# EAGLE design HBridgeShield (EAGLE 8.4.1)
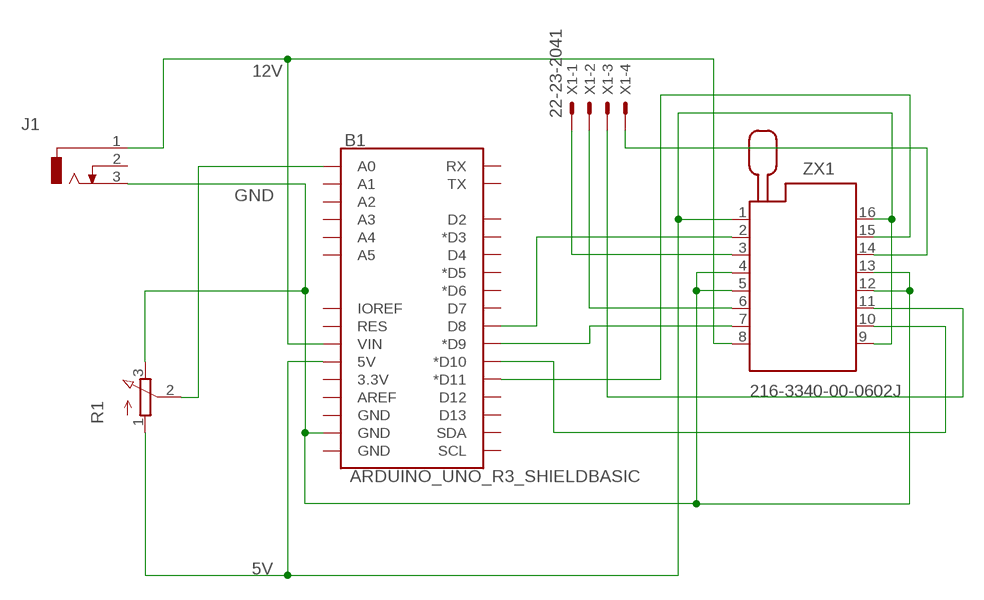
[diagram p0: schematic, sheet 1]

## Parts
B1  ARDUINO_UNO_R3_SHIELDBASIC  [UNO_R3_SHIELD]
J1  DCJ0303  [DCJ0303]
R1  3RP/1610N  [3RP/1610N]
X1  22-23-2041  [22-23-2041]
ZX1  216-3340-00-0602J  [216-3340-00-0602J]

## Nets
5V: B1.5V R1.1(A) ZX1.1 ZX1.9 ZX1.16
12V: B1.VIN J1.1 ZX1.8
GND: B1.GND@1(GND) J1.3 R1.3(E) ZX1.4 ZX1.5 ZX1.12 ZX1.13
N$1: B1.D9(*D9) ZX1.7
N$2: B1.D10(*D10) ZX1.10
N$3: B1.D8 ZX1.2
N$4: B1.D11(*D11) ZX1.15
N$5: X1.1 ZX1.3
N$6: B1.A0 R1.2(S)
N$7: X1.2 ZX1.6
N$8: X1.4 ZX1.14
N$9: X1.3 ZX1.11
Unconnected: B1.3.3V B1.A1 B1.A2 B1.A3 B1.A4 B1.A5 B1.AREF B1.D2 B1.D3(*D3) B1.D4 B1.D5(*D5) B1.D6(*D6) B1.D7 B1.D12 B1.D13 B1.GND@0(GND) B1.GND@2(GND) B1.IOREF B1.RES B1.RX B1.SCL B1.SDA B1.TX J1.2

## Library data of the parts
B1 = SparkFun-Boards:ARDUINO_UNO_R3_SHIELD: Arduino R3 Shield Footprint Shield form compatible with the Arduino Uno R3. SparkFun Products: MG2639 Cellular Shield <https://www.sparkfun.com/products/13120> MIDI Shield <https://www.sparkfun.com/products/12898> R3 Stackable Headers Kit <https://www.sparkfun.com/products/11417>
J1 = con-jack:DCJ0303: DC POWER JACK Source: DCJ0303.pdf; OC_FARNELL: unknown; OC_NEWARK: unknown
R1 = pot:3RP/1610N: 16mm Potentiometer one level Source: http://www.alphapotentiometers.net/html/16mm_pot_2.html
X1 = con-molex:22-23-2041: .100" (2.54mm) Center Header - 4 Pin; MF: MOLEX; MPN: 22-23-2041; OC_FARNELL: 1462920; OC_NEWARK: 38C0355
ZX1 = con-3m:216-3340-00-0602J: Zero Insertion Force Socked Source: http://www.3M.com/ehpd; MF: 3M; MPN: 216-3340-00-0602J; OC_FARNELL: 1674399; OC_NEWARK: 85K7797

## Board
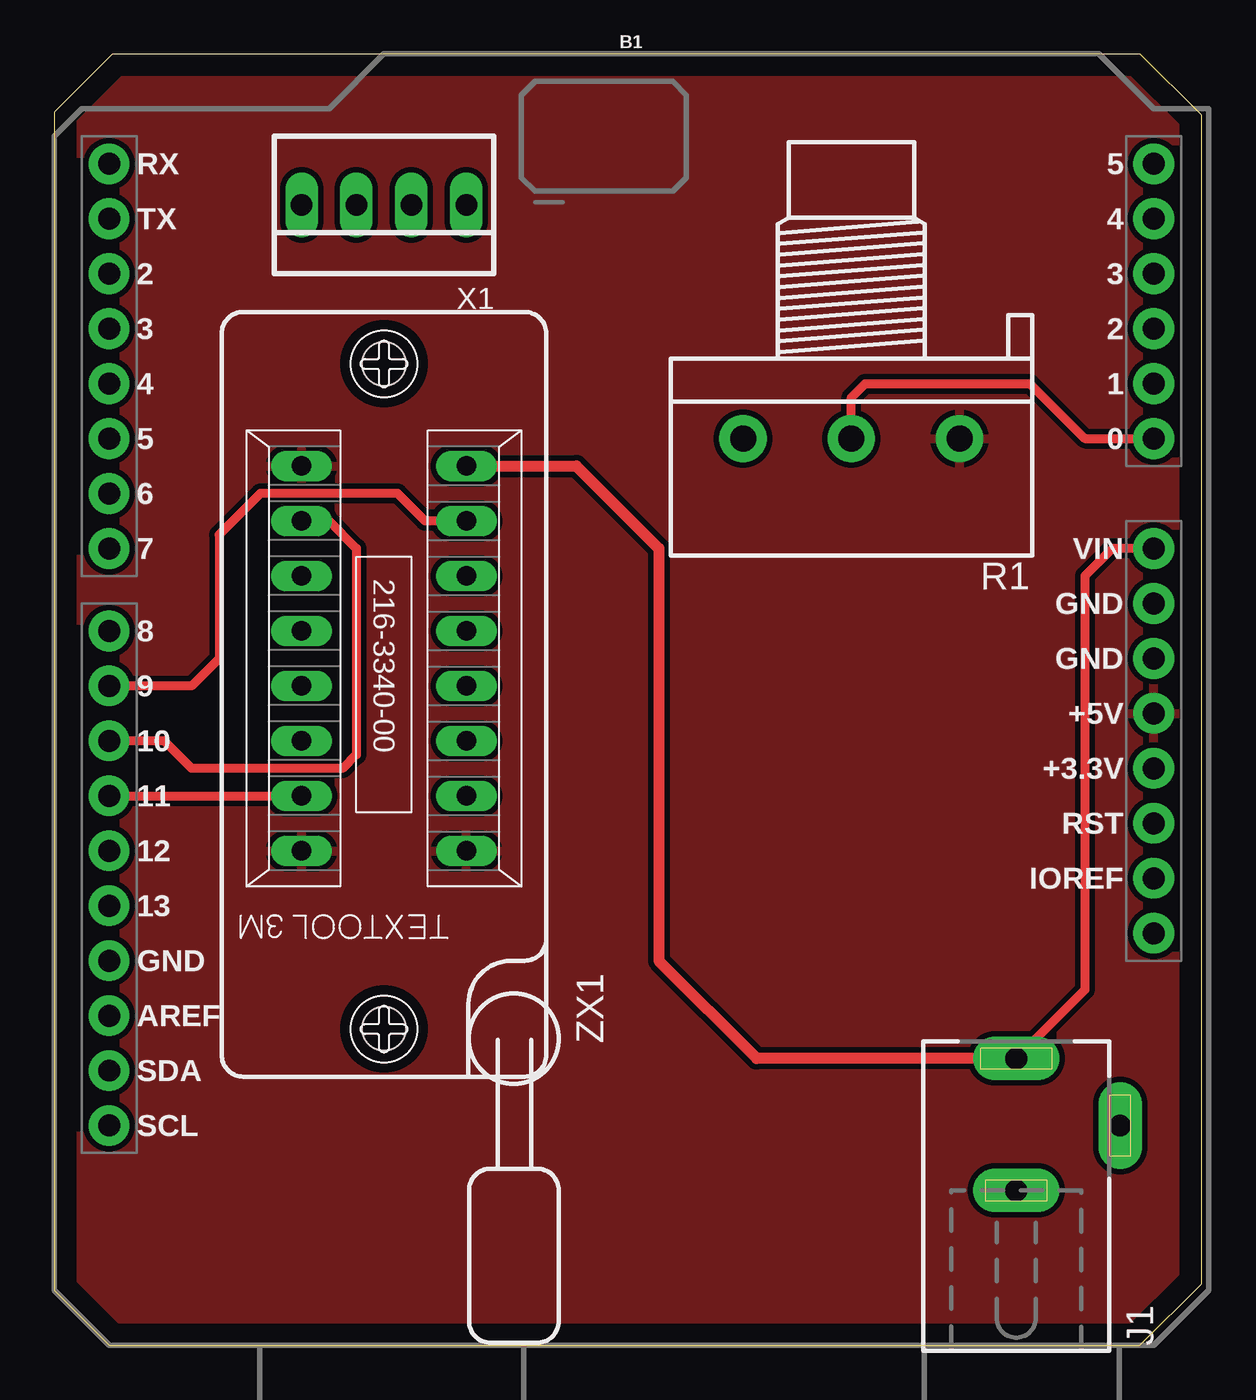
[diagram p1: board, top side]
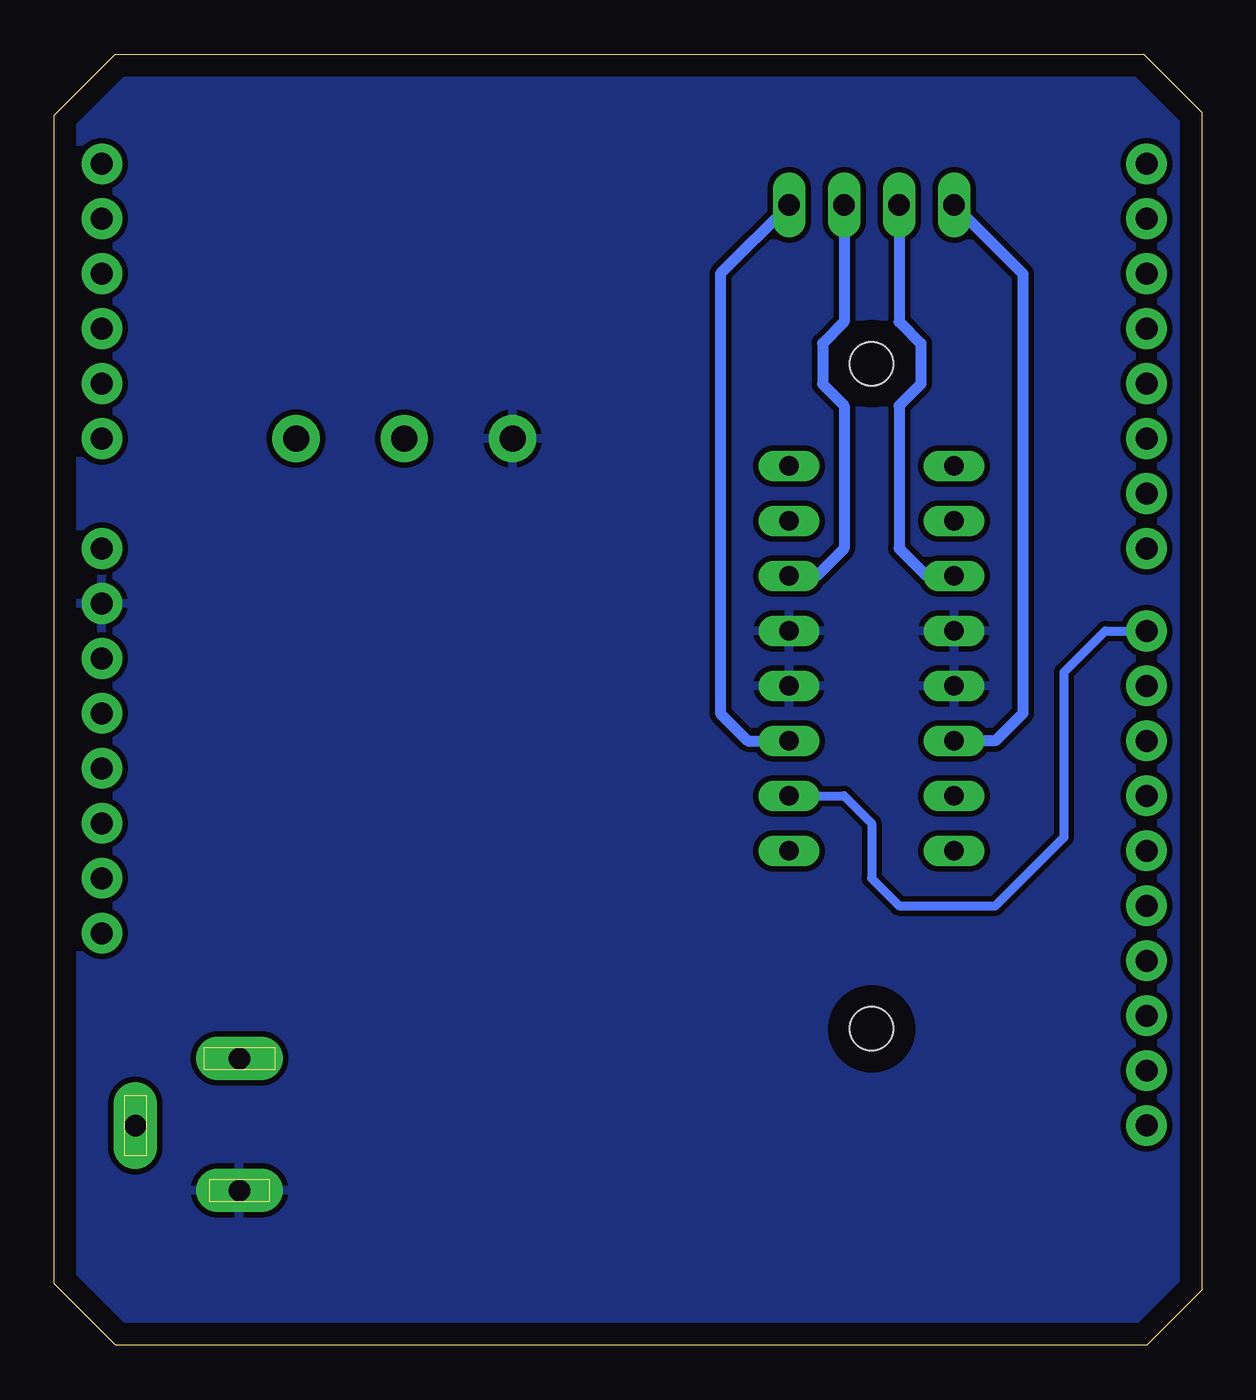
[diagram p2: board, bottom side, seen from below]

Size 53.01 x 59.68 mm. Coordinates in mm from the lower left corner, seen from the top.
Outline: 0,57 0,2.54 2.54,0 50.16,0 53.01,2.85 53.01,56.84 50.17,59.68 2.68,59.68 0,57
Copper layers (1*16): Top 0.035mm / dielectric 1.5mm / Bottom 0.035mm
Design rules "default": minimum track width 6mil, minimum drill 0.35mm, track to track 6mil, track to pad 6mil, pad to pad 6mil, via to via 6mil, smd to smd 6mil, copper to edge 40mil, drill to drill 6mil, minimum pad ring 10mil, minimum via ring 8mil, stop-mask expansion 4mil, vias tented up to drill 0mil, thermal gap 10mil

### Footprints (pad centres in the part's own frame; a part is rotated, then mirrored left to right if it is on the bottom)
UNO_R3_SHIELD = drill 1.016 pad 1.88: 3.3V 24.13,-2.54; 5V 24.13,0; A0 24.13,12.7; A1 24.13,15.24; A2 24.13,17.78; A3 24.13,20.32; A4 24.13,22.86; A5 24.13,25.4; AREF -24.13,-13.97; D2 -24.13,20.32; D3 -24.13,17.78; D4 -24.13,15.24; D5 -24.13,12.7; D6 -24.13,10.16; D7 -24.13,7.62; D8 -24.13,3.81; D9 -24.13,1.27; D10 -24.13,-1.27; D11 -24.13,-3.81; D12 -24.13,-6.35; D13 -24.13,-8.89; GND@0 24.13,2.54; GND@1 24.13,5.08; GND@2 -24.13,-11.43; IOREF 24.13,-7.62; NC 24.13,-10.16; RES 24.13,-5.08; RX -24.13,25.4; SCL -24.13,-19.05; SDA -24.13,-16.51; TX -24.13,22.86; VIN 24.13,7.62
DCJ0303 = drill 1 pad 2 long: 1 0,3.1; 2 4.8,0; 3 0,-3
3RP/1610N = drill 1.2 pad 2.184: 1 -5,0; 2 0,0; 3 5,0
22-23-2041 = drill 1 long: 1 -3.81,0; 2 -1.27,0; 3 1.27,0; 4 3.81,0
216-3340-00-0602J = drill 0.9 long: 1 -8.89,-3.81; 2 -6.35,-3.81; 3 -3.81,-3.81; 4 -1.27,-3.81; 5 1.27,-3.81; 6 3.81,-3.81; 7 6.35,-3.81; 8 8.89,-3.81; 9 8.89,3.81; 10 6.35,3.81; 11 3.81,3.81; 12 1.27,3.81; 13 -1.27,3.81; 14 -3.81,3.81; 15 -6.35,3.81; 16 -8.89,3.81 | hole 2: 13.62,0; -17.12,0

### Placement (x,y rotation side)
B1  26.67,29.21 0 top
J1  44.45,10.16 0 top
R1  36.83,41.91 180 top
X1  15.24,52.7 180 top
ZX1  15.24,31.75 90 top

### Tracks (layer width: path | path; a pad name or v marks a point on that pad's centre or on a via)
5V
  pour Top (isolate 0.254): -1.91,60.96 -1.91,-0.64 56.52,-0.64 56.52,60.96
12V
  Top 0.406: B1.VIN 48.9,36.83 47.62,35.56 47.62,16.43 J1.1
  Top 0.508: ZX1.8 24.13,40.64 27.94,36.83 27.94,17.78 32.46,13.26 J1.1
GND
  pour Bottom (isolate 0.254): -3.81,60.33 -3.81,-1.27 54.61,-1.27 54.61,60.33
N$1
  Top 0.406: ZX1.7 17.78,38.1 17.14,38.1 15.88,39.37 9.53,39.37 7.62,37.47 7.62,31.75 6.35,30.48 B1.D9
N$2
  Top 0.406: ZX1.10 12.7,38.1 13.97,36.83 13.97,27.3 13.34,26.67 6.35,26.67 5.08,27.94 B1.D10
N$3
  Bottom 0.406: ZX1.2 16.51,25.4 15.24,24.13 15.24,21.59 13.97,20.32 9.53,20.32 6.35,23.5 6.35,31.11 4.45,33.02 B1.D8
N$4
  Top 0.406: B1.D11 ZX1.15
N$5
  Bottom 0.508: X1.1 22.23,49.53 22.23,29.21 20.95,27.94 ZX1.3
N$6
  Top 0.406: R1.2 36.83,43.81 37.47,44.45 45.09,44.45 47.62,41.91 B1.A0
N$7
  Bottom 0.508: X1.2 16.51,47.31 17.51,46.31 17.51,44.43 16.51,43.43 16.51,36.83 17.78,35.56 ZX1.6
N$8
  Bottom 0.508: X1.4 8.26,49.53 8.26,29.21 9.53,27.94 ZX1.14
N$9
  Bottom 0.508: X1.3 13.97,47.31 12.97,46.31 12.97,44.43 13.97,43.43 13.97,36.83 12.7,35.56 ZX1.11